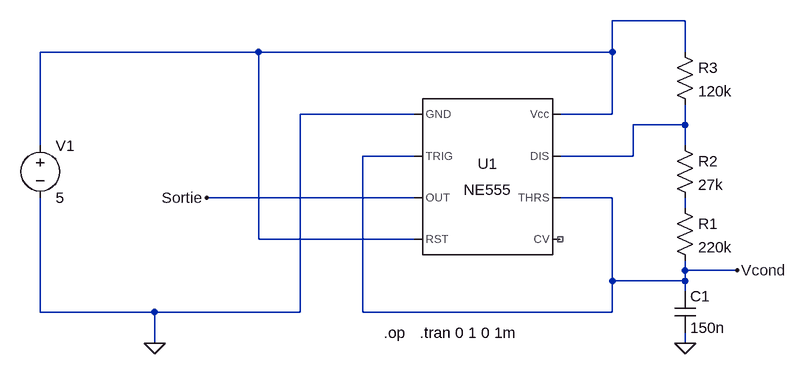
[diagram p0: schematic NE555.asc]
NE555.asc, the LTspice schematic file:
Version 4
SHEET 1 984 680
WIRE 816 -64 704 -64
WIRE 160 -16 -176 -16
WIRE 704 -16 704 -64
WIRE 704 -16 160 -16
WIRE 816 -16 816 -64
WIRE 400 80 224 80
WIRE 704 80 704 -16
WIRE 704 80 624 80
WIRE 816 96 816 64
WIRE 816 96 736 96
WIRE -176 128 -176 -16
WIRE 816 128 816 96
WIRE 400 144 320 144
WIRE 736 144 736 96
WIRE 736 144 624 144
WIRE 400 208 80 208
WIRE 704 208 624 208
WIRE 816 224 816 208
WIRE 160 272 160 -16
WIRE 400 272 160 272
WIRE 816 320 816 304
WIRE 896 320 816 320
WIRE 704 336 704 208
WIRE 816 336 816 320
WIRE 816 336 704 336
WIRE 816 352 816 336
WIRE -176 384 -176 208
WIRE 0 384 -176 384
WIRE 224 384 224 80
WIRE 224 384 0 384
WIRE 320 384 320 144
WIRE 704 384 704 336
WIRE 704 384 320 384
WIRE 0 432 0 384
WIRE 816 432 816 416
FLAG 0 432 0
FLAG 80 208 Sortie
FLAG 816 432 0
FLAG 896 320 Vcond
SYMBOL voltage -176 112 R0
WINDOW 123 0 0 Left 0
WINDOW 39 0 0 Left 0
SYMATTR InstName V1
SYMATTR Value 5
SYMBOL Misc\\NE555 512 176 R0
SYMATTR InstName U1
SYMBOL cap 800 352 R0
SYMATTR InstName C1
SYMATTR Value 150n
SYMBOL res 800 208 R0
SYMATTR InstName R1
SYMATTR Value 220k
SYMBOL res 800 112 R0
SYMATTR InstName R2
SYMATTR Value 27k
SYMBOL res 800 -32 R0
SYMATTR InstName R3
SYMATTR Value 120k
TEXT 408 416 Left 2 !.tran 0 1 0 1m
TEXT 352 416 Left 2 !.op

The netlist it stands for:
* NE555.asc
V1 N001 0 5
XU1 0 Vcond Sortie N001 NC_01 Vcond N002 N001 NE555  ; pins GND TRIG OUT RST CV THRS DIS Vcc
C1 Vcond 0 150n
R1 N003 Vcond 220k
R2 N002 N003 27k
R3 N001 N002 120k
.tran 0 1 0 1m
.op
.lib NE555.sub
.backanno
.end